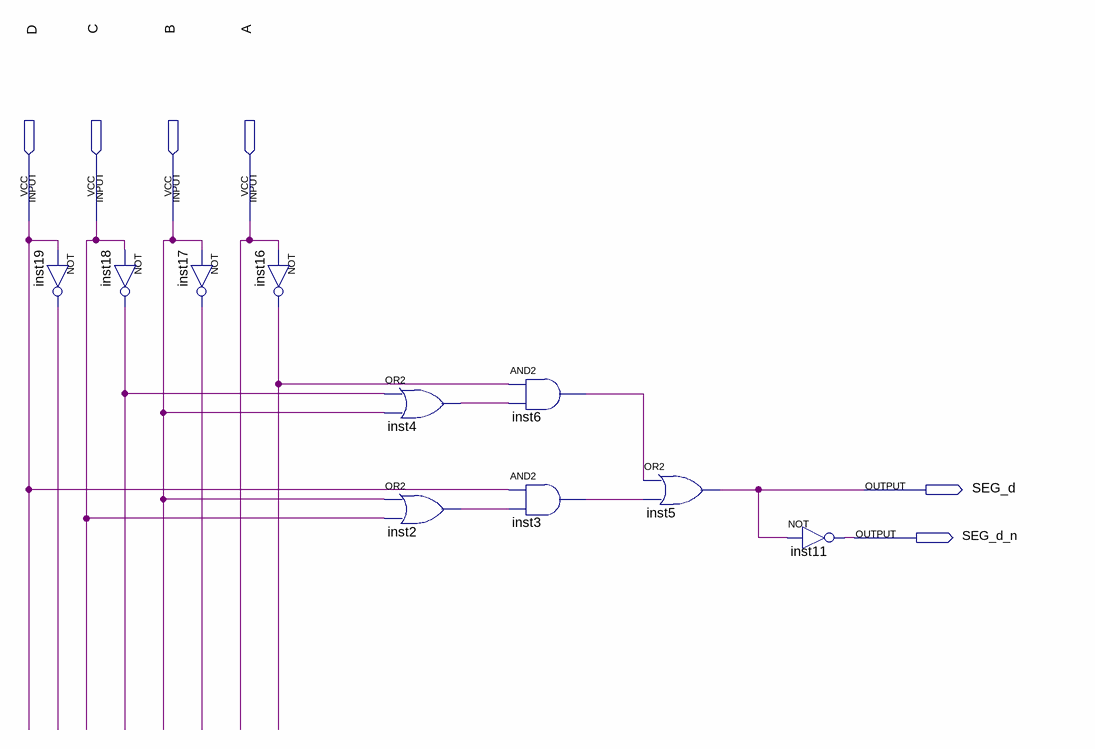
[diagram p0: schematic sheet]
// Quartus schematic SEG_E.bdf as structural Verilog: 10 symbols, 6 pins
module SEG_E (
  input  D,
  input  C,
  input  B,
  input  A,
  output SEG_d,
  output SEG_d_n
);

  wire inst2_out, inst3_out, inst4_out, inst6_out, inst16_out, inst17_out, inst18_out, inst19_out;

  not inst19 (inst19_out, D);
  not inst18 (inst18_out, C);
  not inst17 (inst17_out, B);
  not inst16 (inst16_out, A);
  or inst4 (inst4_out, inst18_out, B);
  or inst2 (inst2_out, B, C);
  and inst6 (inst6_out, inst16_out, inst4_out);
  and inst3 (inst3_out, D, inst2_out);
  or inst5 (SEG_d, inst6_out, inst3_out);
  not inst11 (SEG_d_n, SEG_d);
endmodule
